# EAGLE schematic untitled (EAGLE 9.6.2)
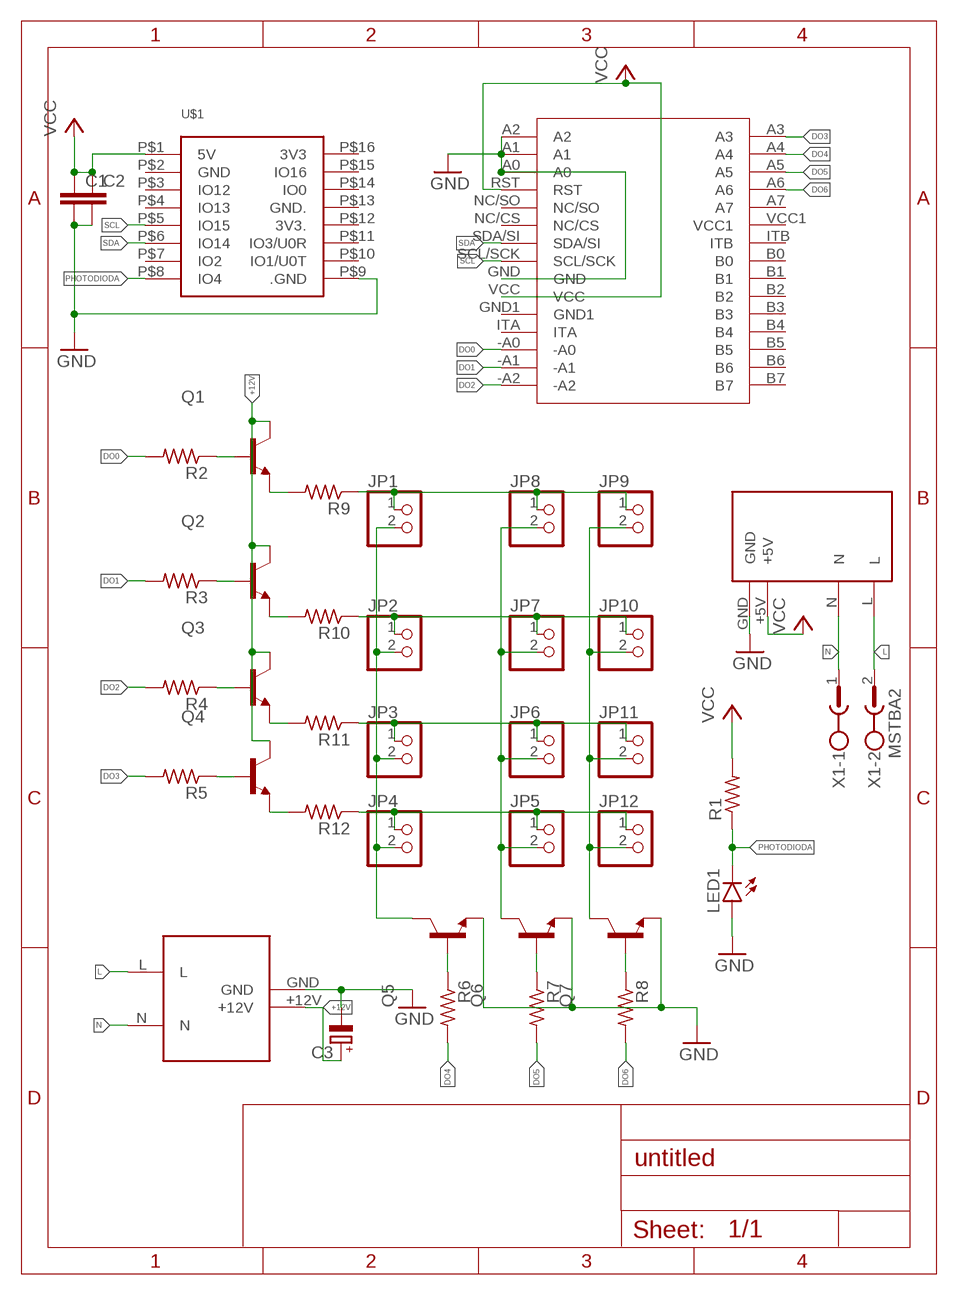
[diagram p0: schematic, sheet 1]

## Parts
C1  C-EUC0805K  [C0805K]
C2  C-EUC0805K  [C0805K]
C3  CPOL-EU153CLV-0505  [153CLV-0505]
HLK-15M1  HLK-15M12  [HLK-15M12]
JP1  PINHD-1X2  [1X02]
JP2  PINHD-1X2  [1X02]
JP3  PINHD-1X2  [1X02]
JP4  PINHD-1X2  [1X02]
JP5  PINHD-1X2  [1X02]
JP6  PINHD-1X2  [1X02]
JP7  PINHD-1X2  [1X02]
JP8  PINHD-1X2  [1X02]
JP9  PINHD-1X2  [1X02]
JP10  PINHD-1X2  [1X02]
JP11  PINHD-1X2  [1X02]
JP12  PINHD-1X2  [1X02]
LED1  LED5MM  [LED5MM]
MCP1  MCP23017  [MCP23017]
Q1  BCW31SMD  [SOT23-BEC]
Q2  BCW31SMD  [SOT23-BEC]
Q3  BCW31SMD  [SOT23-BEC]
Q4  BCW31SMD  [SOT23-BEC]
Q5  BCW31SMD  [SOT23-BEC]
Q6  BCW31SMD  [SOT23-BEC]
Q7  BCW31SMD  [SOT23-BEC]
R1  R-US_M0805  [M0805]
R2  R-US_M0805  [M0805]
R3  R-US_M0805  [M0805]
R4  R-US_M0805  [M0805]
R5  R-US_M0805  [M0805]
R6  R-US_M0805  [M0805]
R7  R-US_M0805  [M0805]
R8  R-US_M0805  [M0805]
R9  R-US_M0805  [M0805]
R10  R-US_M0805  [M0805]
R11  R-US_M0805  [M0805]
R12  R-US_M0805  [M0805]
U$1  ESP32-CAM  [ESP32-CAM]
WX-DC1  WX-DC12003  [WX-DC12003]
X1  MSTBA2  [MSTBA2]

## Nets
+12V: C3.+ HLK-15M1.+12V Q1.C Q2.C Q3.C Q4.C
DO0: MCP1.-A0 R2.2
DO1: MCP1.-A1 R3.2
DO2: MCP1.-A2 R4.2
DO3: MCP1.A3 R5.2
DO4: MCP1.A4 R6.2
DO5: MCP1.A5 R7.2
DO6: MCP1.A6 R8.2
GND: C1.2 C2.2 C3.- HLK-15M1.GND LED1.A MCP1.A0 MCP1.A1 MCP1.A2 MCP1.GND Q5.E Q6.E Q7.E U$1.P$9(.GND) WX-DC1.GND
L: HLK-15M1.L WX-DC1.L X1.2
N: HLK-15M1.N WX-DC1.N X1.1
N$2: Q1.B R2.1
N$3: Q2.B R3.1
N$4: Q3.B R4.1
N$5: Q4.B R5.1
N$6: JP1.2 JP2.2 JP3.2 JP4.2 Q5.C
N$7: Q5.B R6.1
N$8: Q6.B R7.1
N$9: Q7.B R8.1
N$10: Q1.E R9.2
N$11: Q2.E R10.2
N$12: Q3.E R11.2
N$13: Q4.E R12.2
N$14: JP1.1 JP8.1 JP9.1 R9.1
N$15: JP2.1 JP7.1 JP10.1 R10.1
N$16: JP3.1 JP6.1 JP11.1 R11.1
N$17: JP4.1 JP5.1 JP12.1 R12.1
N$18: JP5.2 JP6.2 JP7.2 JP8.2 Q6.C
N$19: JP9.2 JP10.2 JP11.2 JP12.2 Q7.C
PHOTODIODA: LED1.K(C) R1.1 U$1.P$8(IO4)
SCL: MCP1.SCL/SCK U$1.P$5(IO15)
SDA: MCP1.SDA/SI U$1.P$6(IO14)
VCC: C1.1 C2.1 MCP1.RST MCP1.VCC R1.2 U$1.P$1(5V) WX-DC1.+5V
Unconnected: MCP1.A7 MCP1.B0 MCP1.B1 MCP1.B2 MCP1.B3 MCP1.B4 MCP1.B5 MCP1.B6 MCP1.B7 MCP1.GND1 MCP1.ITA MCP1.ITB MCP1.NC/CS MCP1.NC/SO MCP1.VCC1 U$1.P$2(GND) U$1.P$3(IO12) U$1.P$4(IO13) U$1.P$7(IO2) U$1.P$10(IO1/U0T) U$1.P$11(IO3/U0R) U$1.P$12(3V3.) U$1.P$13(GND.) U$1.P$14(IO0) U$1.P$15(IO16) U$1.P$16(3V3)

## Library data of the parts
C1 C2 = rcl:C-EU: CAPACITOR, European symbol; SPICEPREFIX: C
C3 = rcl:CPOL-EU: POLARIZED CAPACITOR, European symbol; SPICEPREFIX: C
HLK-15M1 = HLK-15M12:HLK-15M12
JP1-JP12 = pinhead:PINHD-1X2: PIN HEADER
LED1 = led:LED: LED OSRAM: - CHIPLED LG R971, LG N971, LY N971, LG Q971, LY Q971, LO R971, LY R971 LH N974, LH R974 LS Q976, LO Q976, LY Q976 LO Q996 - Hyper CHIPLED LW Q18S LB Q993, LB Q99A, LB R99A - SideLED LS A670, LO A670, LY A670, LG A670, LP A670 LB A673, LV A673, LT A673, LW A673 LH A674 LY A675 LS A676, LA A676, LO A676, LY A676, LW A676 LS A679, LY A679, LG A679 - Hyper Micro SIDELED® LS Y876, LA Y876, LO Y876, LY Y876 LT Y87S - SmartLED LW L88C, LW L88S LB L89C, LB L89S, LG L890 LS L89K, LO L89K, LY L89K LS L896, LA L896, LO L896, LY L896 - TOPLED LS T670, LO T670, LY T670, LG T670, LP T670 LSG T670, LSP T670, LSY T670, LOP T670, LYG T670 LG T671, LOG T671, LSG T671 LB T673, LV T673, LT T673, LW T673 LH T674 LS T676, LA T676, LO T676, LY T676, LB T676, LH T676, LSB T676, LW T676 LB T67C, LV T67C, LT T67C, LS T67K, LO T67K, LY T67K, LW E67C LS E67B, LA E67B, LO E67B, LY E67B, LB E67C, LV E67C, LT E67C LW T67C LS T679, LY T679, LG T679 LS T770, LO T770, LY T770, LG T770, LP T770 LB T773, LV T773, LT T773, LW T773 LH T774 LS E675, LA E675, LY E675, LS T675 LS T776, LA T776, LO T776, LY T776, LB T776 LHGB T686 LT T68C, LB T68C - Hyper Mini TOPLED® LB M676 - Mini TOPLED Santana® LG M470 LS M47K, LO M47K, LY M47K Source: http://www.osram.convergy.de LUXEON: - LUMILED® LXK2-PW12-R00, LXK2-PW12-S00, LXK2-PW14-U00, LXK2-PW14-V00 LXK2-PM12-R00, LXK2-PM12-S00, LXK2-PM14-U00 LXK2-PE12-Q00, LXK2-PE12-R00, LXK2-PE12-S00, LXK2-PE14-T00, LXK2-PE14-U00 LXK2-PB12-K00, LXK2-PB12-L00, LXK2-PB12-M00, LXK2-PB14-N00, LXK2-PB14-P00, LXK2-PB14-Q00 LXK2-PR12-L00, LXK2-PR12-M00, LXK2-PR14-Q00, LXK2-PR14-R00 LXK2-PD12-Q00, LXK2-PD12-R00, LXK2-PD12-S00 LXK2-PH12-R00, LXK2-PH12-S00 LXK2-PL12-P00, LXK2-PL12-Q00, LXK2-PL12-R00 Source: www.luxeon.com KINGBRIGHT: KA-3528ASYC Source: www.kingbright.com
MCP1 = mcp23017:MCP23017
Q1-Q7 = BCW31_:BCW31*: NPN Transistor Check availability <https://pricing.snapeda.com/parts/BCW31/ON%20Semiconductor/view-part?ref=eda>; AVAILABILITY: In Stock; DESCRIPTION: Bipolar (BJT) Transistor NPN General Purpose Amplifier Surface Mount; MF: ON Semiconductor; MP: BCW31; PACKAGE: SOT-23 ON Semiconductor; PRICE: None; PURCHASE-URL: https://pricing.snapeda.com/search/part/BCW31/?ref=eda
R1-R12 = adafruit:R-US_: RESISTOR, American symbol
U$1 = ESP32-CAM:ESP32-CAM: Check availability <https://pricing.snapeda.com/parts/ESP32-CAM/AI-Thinker/view-part?ref=eda>; AVAILABILITY: In Stock; DESCRIPTION: ESP32 ESP32 Transceiver; 802.11 a/b/g/n (Wi-Fi, WiFi, WLAN), Bluetooth® Smart 4.x Low Energy (BLE) Evaluation Board; MF: AI-Thinker; MP: ESP32-CAM; PACKAGE: None; PRICE: None; PURCHASE-URL: https://pricing.snapeda.com/search/part/ESP32-CAM/?ref=eda
WX-DC1 = WX-DC12003:WX-DC12003
X1 = con-phoenix-508:MSTBA2: PHOENIX; MF: FARNELL; MPN: 1757242; OC_FARNELL: 3705171; OC_NEWARK: 71C4161